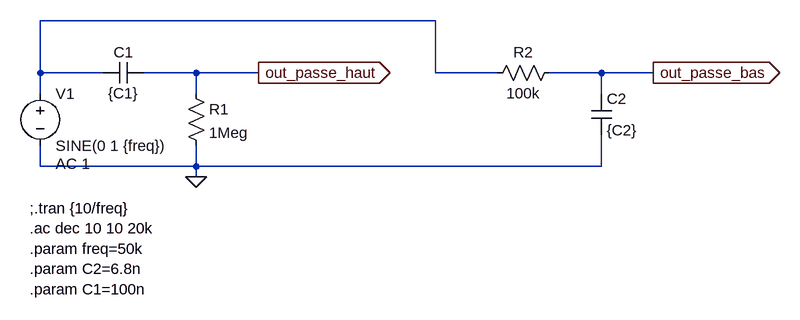
[diagram p0: schematic high-low pass.asc]
high-low pass.asc, the LTspice schematic file:
Version 4
SHEET 1 1192 680
WIRE 624 16 16 16
WIRE 16 96 16 16
WIRE 112 96 16 96
WIRE 256 96 176 96
WIRE 352 96 256 96
WIRE 624 96 624 16
WIRE 720 96 624 96
WIRE 880 96 800 96
WIRE 960 96 880 96
WIRE 16 128 16 96
WIRE 256 128 256 96
WIRE 880 128 880 96
WIRE 16 240 16 208
WIRE 256 240 256 208
WIRE 256 240 16 240
WIRE 880 240 880 192
WIRE 880 240 256 240
WIRE 256 256 256 240
FLAG 352 96 out_passe_haut
IOPIN 352 96 Out
FLAG 256 256 0
FLAG 960 96 out_passe_bas
IOPIN 960 96 Out
SYMBOL voltage 16 112 R0
WINDOW 123 24 124 Left 2
WINDOW 39 0 0 Left 0
SYMATTR Value2 AC 1
SYMATTR InstName V1
SYMATTR Value SINE(0 1 {freq})
SYMBOL res 240 112 R0
SYMATTR InstName R1
SYMATTR Value 1Meg
SYMBOL cap 176 80 R90
WINDOW 0 0 32 VBottom 2
WINDOW 3 32 32 VTop 2
SYMATTR InstName C1
SYMATTR Value {C1}
SYMBOL cap 864 128 R0
SYMATTR InstName C2
SYMATTR Value {C2}
SYMBOL res 816 80 R90
WINDOW 0 0 56 VBottom 2
WINDOW 3 32 56 VTop 2
SYMATTR InstName R2
SYMATTR Value 100k
TEXT 0 304 Left 2 !;.tran {10/freq}\n.ac dec 10 10 20k\n.param freq=50k\n.param C2=6.8n\n.param C1=100n

The netlist it stands for:
* high-low pass.asc
V1 N001 0 SINE(0 1 {freq}) AC 1
R1 out_passe_haut 0 1Meg
C1 out_passe_haut N001 {C1}
C2 out_passe_bas 0 {C2}
R2 out_passe_bas N001 100k
;.tran {10/freq}
.ac dec 10 10 20k
.param freq=50k
.param C2=6.8n
.param C1=100n
.backanno
.end